# Altium schematic sheet UserOutput.SchDoc
size A0
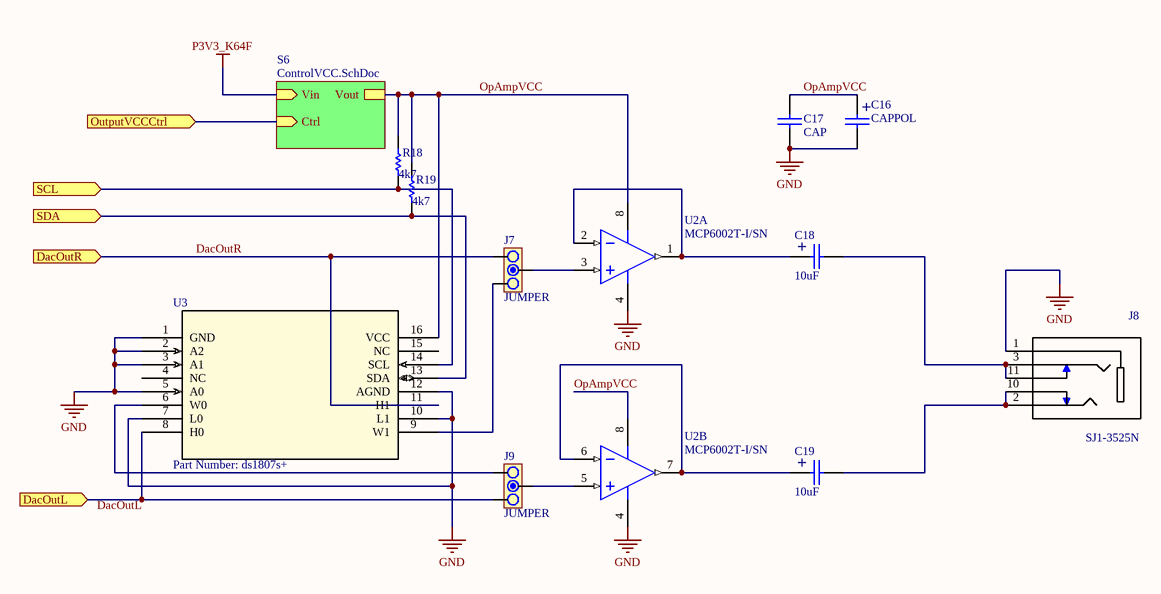
[diagram p0: UserOutput.SchDoc]

## Parts
C16  CAPPOL  [CAP100RP]
C17  CAP  [0805]
C18  10uF  [CAP100RP]
C19  10uF  [CAP100RP]
J7  JUMPER  [JUMPER3]
J8  SJ1-3525N  [*CUI_SJ1-3525N]
J9  JUMPER  [JUMPER3]
R18  4k7  [0805]
R19  4k7  [0805]
U2  MCP6002T-I/SN  [SOIC-SN8_N]  (parts A,B of 2)
U3  Part Number: ds1807s+  [21-0042B_16]

## Sub-sheets
S6 = ControlVCC.SchDoc: Vin (in), Vout, Ctrl (in)

## Ports
DacOutL (in), DacOutR (in), OutputVCCCtrl (in), SCL (in), SDA (in)

## Nets
GND: C16.2 C17.2 J8.1 U2.4(VSS) U3.1(GND) U3.2(A2) U3.3(A1) U3.5(A0) U3.7(L0) U3.10(L1) U3.12(AGND)
P3V3_K64F: sheet S6/Vin
DacOutL: J9.1 U3.8(H0) ; port DacOutL
DacOutR: J7.3 U3.11(H1) ; port DacOutR
OpAmpVCC: C16.1 C17.1 R18.2 R19.2 U2.8(VDD) U3.16(VCC) ; sheet S6/Vout
OutputVCCCtrl: port OutputVCCCtrl, sheet S6/Ctrl
SCL: R18.1 U3.14(SCL) ; port SCL
SDA: R19.1 U3.13(SDA) ; port SDA
NetC18_1: C18.1 U2.1(VOUTA) U2.2(VINA-)
NetC18_2: C18.2 J8.3 J8.11
NetC19_1: C19.1 U2.6(VINB-) U2.7(VOUTB)
NetC19_2: C19.2 J8.2 J8.10
NetJ7_1: J7.1 U3.9(W1)
NetJ7_2: J7.2 U2.3(VINA+)
NetJ9_2: J9.2 U2.5(VINB+)
NetJ9_3: J9.3 U3.6(W0)

Not connected (* = marked no-connect by the designer): U3 4(NC) 15(NC)

## Notes on the sheet
- Labels drawn without touching a wire or pin: DacOutL
- (in symbol CAPPOL) +

## Library data of the parts
C18 C19 = CAPPOL
J7 J9 = JUMPER3
R18 R19 = RES
U2 = MCP6002T-I/SN: 1 MHz, Low-Power Operational Amplifier, 8-Pin SOIC, Industrial Temperature, Tape and Reel; Published: 29-Jan-2009; LatestRevisionDate: 02-Dec-2009; LatestRevisionNote: Updated to datasheet revision J, Nov-2009; DatasheetVersion: revJ, Nov-2009; PackageVersion: revBB, Aug-2009; PackageReference: SOIC-SN8; Publisher: Altium Limited; PackageDescription: 8-Lead Plastic Small Outline (SN) - Narrow, 3.90mm Body [SOIC]; Supplier 1: Digi-Key; Supplier Part Number 1: MCP6002T-I/SN-ND; Code_JEDEC: MS-012; Code_IPC: SOIC127P600-8; ComponentLink1Description: Datasheet; ComponentLink1URL: http://ww1.microchip.com/downloads/en/DeviceDoc/21733j.pdf; ComponentLink2Description: Packaging Specification; ComponentLink2URL: http://www.microchip.com/stellent/groups/techpub_sg/documents/packagingspec/en012702.pdf; ComponentLink3Description: Microchip.com Home; ComponentLink3URL: http://www.microchip.com/
U3 = ds1807s+: No Description Available; Vendor: Maxim Integrated Products; Built_By: EMA_UL_Team; Manufacturer_Part_Number: ds1807s+; Copyright: Copyright (C) 2018 Accelerated Designs. All rights reserved; RefDes: RefDes; Type: DEV; Value: Value
J8 = SJ1-3525N: Value: *